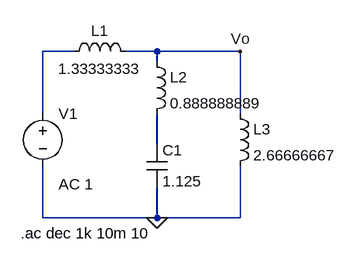
[diagram p0: schematic Ejercicio_a.asc]
Ejercicio_a.asc, the LTspice schematic file:
Version 4
SHEET 1 880 680
WIRE 80 144 32 144
WIRE 208 144 160 144
WIRE 336 144 208 144
WIRE 208 160 208 144
WIRE 32 240 32 144
WIRE 336 240 336 144
WIRE 208 288 208 240
WIRE 32 400 32 320
WIRE 208 400 208 352
WIRE 208 400 32 400
WIRE 336 400 336 320
WIRE 336 400 208 400
FLAG 208 400 0
FLAG 336 144 Vo
SYMBOL ind 64 160 R270
WINDOW 0 32 56 VTop 2
WINDOW 3 5 56 VBottom 2
SYMATTR InstName L1
SYMATTR Value 1.33333333
SYMBOL ind 192 144 R0
SYMATTR InstName L2
SYMATTR Value 0.888888889
SYMBOL ind 320 224 R0
SYMATTR InstName L3
SYMATTR Value 2.66666667
SYMBOL cap 192 288 R0
SYMATTR InstName C1
SYMATTR Value 1.125
SYMBOL voltage 32 224 R0
WINDOW 123 24 124 Left 2
WINDOW 39 0 0 Left 0
SYMATTR InstName V1
SYMATTR Value ""
SYMATTR Value2 AC 1
TEXT -2 424 Left 2 !.ac dec 1k 10m 10

The netlist it stands for:
* Ejercicio_a.asc
L1 N001 Vo 1.33333333
L2 Vo N002 0.888888889
L3 Vo 0 2.66666667
C1 N002 0 1.125
V1 N001 0 AC 1
.ac dec 1k 10m 10
.backanno
.end